# Altium schematic sheet PWR_P5V0.SchDoc: Fast Servo
size 297 x 209 mm; Organization: Altium Limited; Address1: L3, 12a Rodborough Rd; Address2: Frenchs Forest; Address3: NSW; Address4: Australia 2086; DocumentNumber: 23; SheetNumber: 23; SheetTotal: 28; Title2: Power +5 V
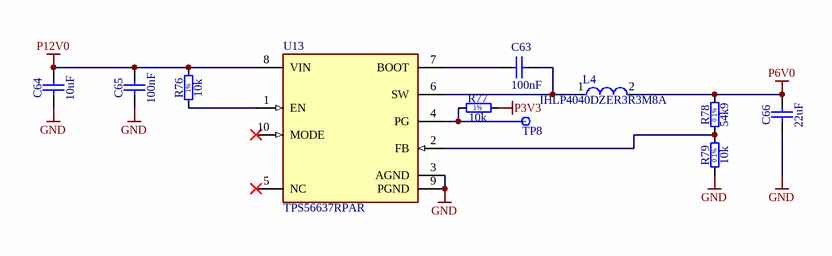
[diagram p0: PWR_P5V0.SchDoc]

## Parts
C63  100nF  [CAPC1005X55N]
C64  10uF  [CAPC2012X95N]
C65  100nF  [CAPC1005X55N]
C66  22uF  [CAPC2012X135N]
L4  IHLP4040DZER3R3M8A  [FP-IHLP4040DZER3R3M8A-MFG]
R76  10k  [RESC1005X40N]
R77  10k  [RESC1005X40N]
R78  54k9  [RESC1608X55N]
R79  10k  [RESC1608X55N]
TP8  Test Point  [TPS127]  (value not drawn)
U13  TPS56637RPAR  [FP-RPA0010A-MFG]

## Nets
GND: C64.1 C65.1 C66.1 R79.1 U13.3(AGND) U13.9(PGND)
P3V3: R77.2
P6V0: C66.2 L4.2 R78.2
P12V0: C64.2 C65.2 R76.2 U13.8(VIN)
NetC63_1: C63.1 L4.1 U13.6(SW)
NetC63_2: C63.2 U13.7(BOOT)
NetR76_1: R76.1 U13.1(EN)
NetR77_1: R77.1 TP8.1 U13.4(PG)
NetR78_1: R78.1 R79.2 U13.2(FB)

Not connected (* = marked no-connect by the designer): U13 5(NC)* 10(MODE)*

## Notes on the sheet
- Project
- Document
- Designer
- Drawn by
- Check.by
- File
- Last Mod.
- Print Date
- Sheet
- Size
- A4
- of
- Rev
- (in symbol R0402_10K_1%_0.0625W_100PPM) 1%
- (in symbol R0603_10K_0.1%_0.063W_10PPM) 0.1%
- (in symbol R0603_54K9_0.1%_0.063W_10PPM) 0.1%

## Library data of the parts
C63 C65 = CC0402_100NF_16V_10%_X5R: Non-polarised capacitor; Part Description: SMD Multilayer Chip Ceramic Capacitor; Manufacturer: GENERIC; Manufacturer1 Part Number: GRM155R61C104KA88D; Voltage: 16V; TC: X5R; Tolerance: ±10%; Part Number: CC0402_100NF_16V_10%_X5R; Component Kind: Standard; Component Type: Standard; Pin Count: 2; Value: 100nF; Status: None; Manufacturer Part Number: CC0402_100NF_16V_10%_X5R; Case: 0402; Mounted: Yes; Socket: No; SMD: Yes; Sense: No; Manufacturer1 Example: MURATA; Manufacturer1 ComponentHeight: 0.55mm; HelpURL: \\cern.ch\dfs\Applications\Altium\Datasheets\CC0402_X5R_MURATA_GRM.pdf; Author: CERN DEM JLC; CreateDate: 10.12.2013; LatestRevisionDate: 10.12.2013
C64 = CC0805_10UF_25V_10%_X5R: Non-polarised capacitor; Part Description: SMD Multilayer Chip Ceramic Capacitor; Manufacturer: GENERIC; Manufacturer1 Part Number: GRM219R61E106KA12D; Voltage: 25V; TC: X5R; Tolerance: ±10%; Part Number: CC0805_10UF_25V_10%_X5R; Component Kind: Standard; Component Type: Standard; Pin Count: 2; Value: 10uF; Status: Preferred; Manufacturer Part Number: CC0805_10UF_25V_10%_X5R; Case: 0805; Mounted: Yes; Socket: No; SMD: Yes; Sense: No; Manufacturer1 Example: MURATA; Manufacturer1 ComponentHeight: 0.95mm; HelpURL: \\cern.ch\dfs\Applications\Altium\Datasheets\CC0805_X5R_MURATA_GRM.pdf; Author: CERN DEM JLC; CreateDate: 25-Oct-12; LatestRevisionDate: 06-Sep-16
C66 = CC0805_22UF_16V_10%_X5R: Non-polarised capacitor; Part Description: SMD Multilayer Chip Ceramic Capacitor; Manufacturer: GENERIC; Manufacturer1 Part Number: C2012X5R1C226KT; Voltage: 16V; TC: X5R; Tolerance: ±10%; Part Number: CC0805_22UF_16V_10%_X5R; Component Kind: Standard; Component Type: Standard; Pin Count: 2; Value: 22uF; Status: Preferred; Manufacturer Part Number: CC0805_22UF_16V_10%_X5R; Case: 0805; Mounted: Yes; Socket: No; SMD: Yes; Sense: No; Manufacturer1 Example: TDK; Manufacturer1 ComponentHeight: 1.35mm; HelpURL: \\cern.ch\dfs\Applications\Altium\Datasheets\CC0805_X5R_TDK_C.pdf; Author: CERN DEM JLC; CreateDate: 25-Oct-12; LatestRevisionDate: 25-Oct-12
L4 = CMP-02424-000011-1: FIXED IND 3.3UH 11A 11.81 MOHM; Manufacturer: Vishay; Shielding: true; Self Resonant Frequency: 25.5MHz; Test Frequency: 100kHz; Saturation Current: 12A; Automotive Grade: Grade 0; Tolerance: 20%; Series Resistance: 11.81mΩ; Temperature Range High: +180°C; Manufacturer Part Number: IHLP4040DZER3R3M8A; Temperature: -55°C to +180°C; Height: 4mm; Device Class L3: Fixed Inductors; Mouser Description: Inductor Power Shielded Wirewound 3.3uH 20% 100KHz Powdered Iron 11A 11.81mOhm DCR 4040 Automotive T/R; Digikey Description: FIXED IND 3.3UH 11A 11.81 MOHM; Lead Free: Yes; Value: 3.3uH; ComponentLink2Description: Datasheet; ComponentLink2URL: http://www.vishay.com/docs/34363/ihlp4040dz8a.pdf; Device Class L1: Passive Components; Automotive: Yes; Octopart: https://octopart.com/ihlp4040dzer3r3m8a-vishay-52741166; Category: Ind; Rms Current: 11A; Temperature Range Low: -55°C; Package: 0; Device Class L2: Inductors; Inductance: 3.3uH; RoHS: TRUE
R76 R77 = R0402_10K_1%_0.0625W_100PPM: Resistor - 1%; Part Description: General Purpose Thick Film Chip Resistor; Manufacturer: GENERIC; Manufacturer1 Part Number: 232270671003L; PressFit: No; TC: ±100ppm/°C; Part Number: R0402_10K_1%_0.0625W_100PPM; Component Kind: Standard; Component Type: Standard; Pin Count: 2; Value: 10k; Status: Not Recommended; Manufacturer Part Number: R0402_10K_1%_0.0625W_100PPM; Case: 0402; Mounted: Yes; Sense: No; Socket: No; SMD: Yes; Manufacturer1 Example: YAGEO PHYCOMP; Manufacturer1 ComponentHeight: 0.4mm; HelpURL: \\cern.ch\dfs\Applications\Altium\Datasheets\R0402_Phycomp_RC0402.pdf; Author: CERN DEM JLC; CreateDate: 03-Dec-07; LatestRevisionDate: 17-Oct-12; Power: 0.0625W; Tolerance: ±1%
R78 = R0603_54K9_0.1%_0.063W_10PPM: Resistor - 0.1%; Part Description: Thin Film Chip Resistor; Manufacturer: GENERIC; Manufacturer1 Part Number: RN73C1J54K9BTDF; PressFit: No; Power: 0.063W; TC: ±10ppm; Part Number: R0603_54K9_0.1%_0.063W_10PPM; Component Kind: Standard; Component Type: Standard; Pin Count: 2; Value: 54k9; Status: Not Recommended; Manufacturer Part Number: R0603_54K9_0.1%_0.063W_10PPM; Case: 0603; Mounted: Yes; Sense: No; Socket: No; SMD: Yes; Manufacturer1 Example: TYCO HOLSWORTHY; Manufacturer1 ComponentHeight: 0.5mm; HelpURL: \\cern.ch\dfs\Applications\Altium\Datasheets\R0603_Tyco_RN73.pdf; Author: CERN DEM JLC; CreateDate: 03-Dec-07; LatestRevisionDate: 13-Mar-08; Tolerance: ±0.1%
R79 = R0603_10K_0.1%_0.063W_10PPM: Resistor - 0.1%; Part Description: Thin Film Chip Resistor; Manufacturer: GENERIC; Manufacturer1 Part Number: RN73C1J10KBTDF; PressFit: No; Power: 0.063W; TC: ±10ppm; Part Number: R0603_10K_0.1%_0.063W_10PPM; Component Kind: Standard; Component Type: Standard; Pin Count: 2; Value: 10k; Status: Not Recommended; Manufacturer Part Number: R0603_10K_0.1%_0.063W_10PPM; Case: 0603; Mounted: Yes; Sense: No; Socket: No; SMD: Yes; Manufacturer1 Example: TYCO HOLSWORTHY; Manufacturer1 ComponentHeight: 0.5mm; HelpURL: \\cern.ch\dfs\Applications\Altium\Datasheets\R0603_Tyco_RN73.pdf; Author: CERN DEM JLC; CreateDate: 03-Dec-07; LatestRevisionDate: 13-Mar-08; Tolerance: ±0.1%
TP8 = SMD_PAD_1.27X1.27MM: Part Description: 1.27mm x 1.27mm PCB Copper Area (SMD Test Point); Mounted: No; Part Number: SMD_PAD_1.27X1.27MM; Component Kind: Standard (No BOM); Component Type: Standard (No BOM); Pin Count: 1; Family: Test Point; Socket: No; SMD: Yes; Sense: No; Status: None; ComponentHeight: 0mm; HelpURL: Undefined; Author: CERN DEM JLC; CreateDate: 12.01.2008; LatestRevisionDate: 12.01.2008; PackageDescription: 1.27mm x 1.27mm PCB Copper Area (SMD Test Point)
U13 = CMP-04918-000008-1: IC POWER MANAGEMENT; Manufacturer: Texas Instruments; Max Duty Cycle: 91%; Nominal Supply Current: 140uA; Max Supply Voltage: 28V; Output Current: 6A; Switching Frequency: 500kHz; Output Type: AdjustableProgrammable; Max Junction Temp: +150°C; Output Voltage: 0.6-13V; Switching Topology: Buck; Standoff Height: 0mm; Number Of Outputs: 1; Min Supply Voltage: 4.5V; Automotive: No; Manufacturer Part Number: TPS56637RPAR; Lead Free: Yes; Temperature Range Low: -40°C; Digikey Description: IC POWER MANAGEMENT; Octopart: https://octopart.com/tps56637rpar-texas+instruments-97650653; Temperature: -40°C to +150°C; Device Class L3: Voltage Regulators - Switching; Temperature Range High: +150°C; Package: RPA0010A; Device Class L2: Power Management ICs; ComponentLink2URL: http://www.ti.com/lit/ds/symlink/tps56637.pdf; Device Class L1: Integrated Circuits (ICs); RoHS: TRUE; ComponentLink2Description: Datasheet; Height: 1mm; Category: IC